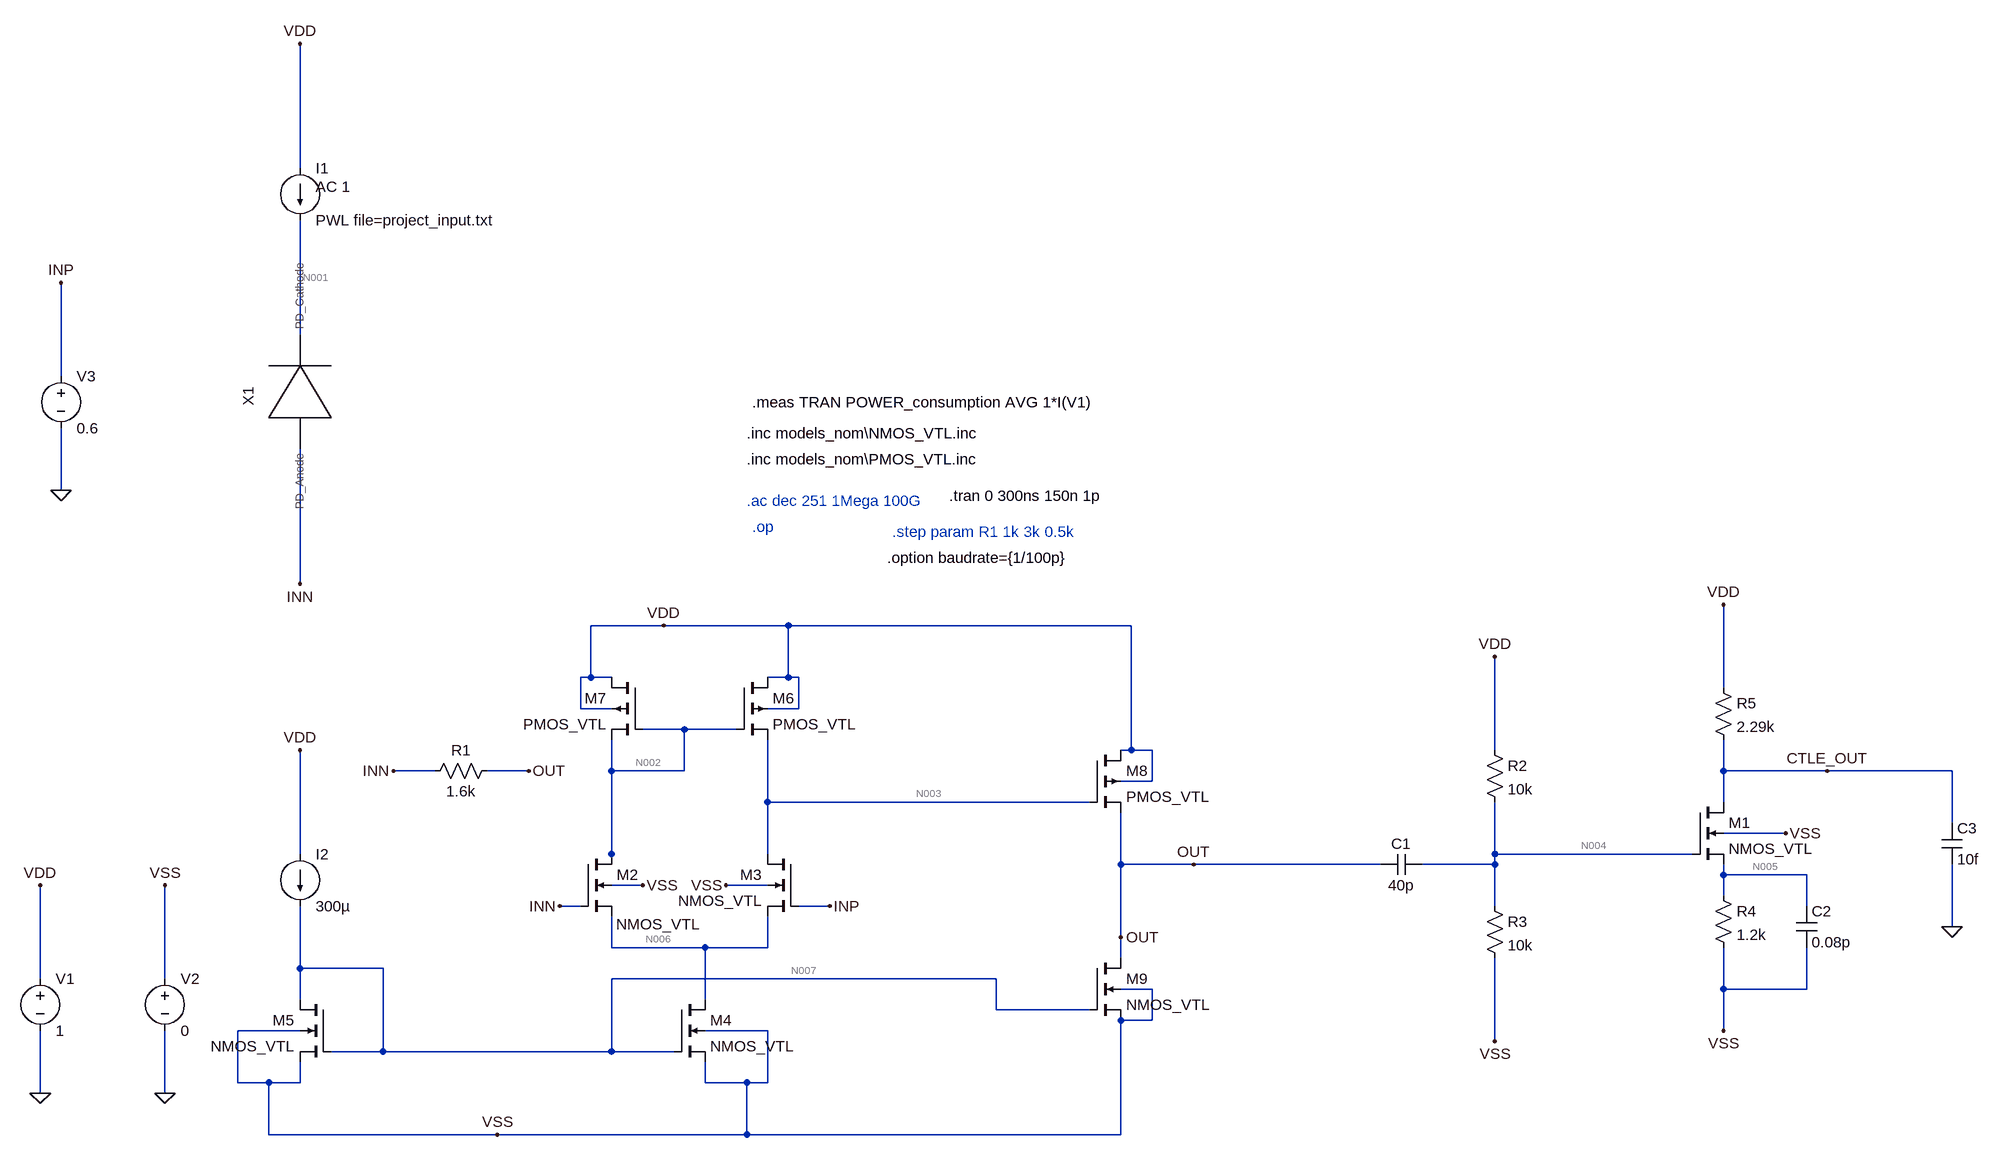
[diagram p0: schematic Project_2.asc]
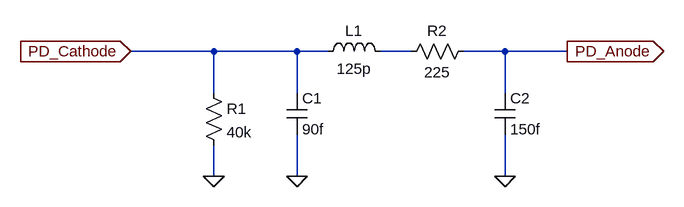
[diagram p1: sub-circuit photodiode.asc]
Project_2.asc, the LTspice schematic file:
Version 4
SHEET 1 1856 1004
WIRE -736 -528 -736 -720
WIRE -736 -272 -736 -448
WIRE -1104 -208 -1104 -352
WIRE -1104 -32 -1104 -128
WIRE -736 112 -736 -96
WIRE -176 176 -288 176
WIRE 16 176 -176 176
WIRE 544 176 16 176
WIRE -288 256 -288 176
WIRE -288 256 -304 256
WIRE -256 256 -288 256
WIRE 16 256 16 176
WIRE 16 256 -16 256
WIRE 32 256 16 256
WIRE 1456 272 1456 144
WIRE -304 304 -304 256
WIRE -256 304 -304 304
WIRE 32 304 32 256
WIRE 32 304 -16 304
WIRE -144 336 -208 336
WIRE -64 336 -144 336
WIRE 544 368 544 176
WIRE 544 368 528 368
WIRE 576 368 544 368
WIRE 1104 368 1104 224
WIRE -528 400 -592 400
WIRE -384 400 -448 400
WIRE -256 400 -256 352
WIRE -144 400 -144 336
WIRE -144 400 -256 400
WIRE 1456 400 1456 352
WIRE 1616 400 1456 400
WIRE 1808 400 1616 400
WIRE 576 416 576 368
WIRE 576 416 528 416
WIRE -16 448 -16 352
WIRE 480 448 -16 448
WIRE 1456 448 1456 400
WIRE 1808 480 1808 400
WIRE 1552 496 1456 496
WIRE -736 528 -736 368
WIRE -256 528 -256 400
WIRE -16 528 -16 448
WIRE 1104 528 1104 448
WIRE 1408 528 1104 528
WIRE -256 544 -256 528
WIRE 528 544 528 464
WIRE 640 544 528 544
WIRE 928 544 640 544
WIRE 1104 544 1104 528
WIRE 1104 544 992 544
WIRE 1456 560 1456 544
WIRE 1584 560 1456 560
WIRE -208 576 -256 576
WIRE -16 576 -80 576
WIRE 1456 592 1456 560
WIRE -304 608 -336 608
WIRE 80 608 32 608
WIRE 1104 608 1104 544
WIRE 1584 608 1584 560
WIRE 1808 640 1808 544
WIRE 528 656 528 544
WIRE -256 672 -256 624
WIRE -112 672 -256 672
WIRE -16 672 -16 624
WIRE -16 672 -112 672
WIRE 528 688 528 656
WIRE -736 704 -736 608
WIRE -608 704 -736 704
WIRE -1136 720 -1136 576
WIRE -944 720 -944 576
WIRE 336 720 -256 720
WIRE 576 736 528 736
WIRE 1456 736 1456 672
WIRE 1584 736 1584 672
WIRE 1584 736 1456 736
WIRE -736 752 -736 704
WIRE -112 752 -112 672
WIRE 336 768 336 720
WIRE 480 768 336 768
WIRE 576 784 576 736
WIRE 576 784 528 784
WIRE -736 800 -832 800
WIRE -16 800 -112 800
WIRE 1456 800 1456 736
WIRE 1104 816 1104 688
WIRE -608 832 -608 704
WIRE -608 832 -688 832
WIRE -256 832 -256 720
WIRE -256 832 -608 832
WIRE -160 832 -256 832
WIRE -832 880 -832 800
WIRE -784 880 -832 880
WIRE -736 880 -736 848
WIRE -736 880 -784 880
WIRE -112 880 -112 848
WIRE -48 880 -112 880
WIRE -16 880 -16 800
WIRE -16 880 -48 880
WIRE -1136 896 -1136 800
WIRE -944 896 -944 800
WIRE -784 960 -784 880
WIRE -432 960 -784 960
WIRE -48 960 -48 880
WIRE -48 960 -432 960
WIRE 528 960 528 784
WIRE 528 960 -48 960
FLAG -1136 896 0
FLAG -944 896 0
FLAG -944 576 VSS
FLAG -1136 576 VDD
FLAG -1104 -32 0
FLAG -1104 -352 INP
FLAG -736 -720 VDD
FLAG -736 112 INN
FLAG -592 400 INN
FLAG -384 400 OUT
FLAG 640 544 OUT
FLAG 1104 224 VDD
FLAG 1104 816 VSS
FLAG 1456 800 VSS
FLAG 1808 640 0
FLAG 1456 144 VDD
FLAG 1552 496 VSS
FLAG 1616 400 CTLE_OUT
FLAG -736 368 VDD
FLAG -336 608 INN
FLAG 80 608 INP
FLAG -208 576 VSS
FLAG -80 576 VSS
FLAG -432 960 VSS
FLAG -176 176 VDD
FLAG 528 656 OUT
DATAFLAG -736 80 ""
DATAFLAG -736 -352 ""
DATAFLAG -736 -640 ""
DATAFLAG 1744 400 ""
DATAFLAG 1280 528 ""
DATAFLAG 1488 560 ""
DATAFLAG -144 336 ""
DATAFLAG -736 384 ""
DATAFLAG -736 656 ""
DATAFLAG 224 448 ""
DATAFLAG 272 720 ""
DATAFLAG -480 832 ""
DATAFLAG 528 544 ""
DATAFLAG 64 176 ""
DATAFLAG -112 704 ""
DATAFLAG 64 608 ""
DATAFLAG -336 608 ""
SYMBOL voltage -1136 704 R0
WINDOW 123 0 0 Left 0
WINDOW 39 0 0 Left 0
SYMATTR InstName V1
SYMATTR Value 1
SYMBOL voltage -944 704 R0
WINDOW 123 0 0 Left 0
WINDOW 39 0 0 Left 0
SYMATTR InstName V2
SYMATTR Value 0
SYMBOL photodiode -736 -176 R270
SYMATTR InstName X1
SYMBOL current -736 -528 R0
WINDOW 123 24 28 Left 2
WINDOW 39 0 0 Left 0
SYMATTR Value2 AC 1
SYMATTR InstName I1
SYMATTR Value PWL file=project_input.txt
SYMBOL voltage -1104 -224 R0
WINDOW 123 0 0 Left 0
WINDOW 39 0 0 Left 0
SYMATTR InstName V3
SYMATTR Value 0.6
SYMBOL res -432 384 R90
WINDOW 0 0 56 VBottom 2
WINDOW 3 32 56 VTop 2
SYMATTR InstName R1
SYMATTR Value 1.6k
SYMBOL nmos4 1408 448 R0
SYMATTR InstName M1
SYMATTR Value NMOS_VTL
SYMATTR Value2 l=45n w=2.5u
SYMBOL cap 992 528 R90
WINDOW 0 0 32 VBottom 2
WINDOW 3 32 32 VTop 2
SYMATTR InstName C1
SYMATTR Value 40p
SYMBOL res 1088 352 R0
SYMATTR InstName R2
SYMATTR Value 10k
SYMBOL res 1088 592 R0
SYMATTR InstName R3
SYMATTR Value 10k
SYMBOL res 1440 576 R0
SYMATTR InstName R4
SYMATTR Value 1.2k
SYMBOL cap 1568 608 R0
SYMATTR InstName C2
SYMATTR Value 0.08p
SYMBOL res 1440 256 R0
SYMATTR InstName R5
SYMATTR Value 2.29k
SYMBOL cap 1792 480 R0
SYMATTR InstName C3
SYMATTR Value 10f
SYMBOL nmos4 -304 528 R0
WINDOW 3 55 108 Left 2
SYMATTR Value NMOS_VTL
SYMATTR InstName M2
SYMATTR Value2 l=45n w=4.5u
SYMBOL nmos4 32 528 M0
SYMATTR InstName M3
SYMATTR Value NMOS_VTL
SYMATTR Value2 l=45n w=4.5u
SYMBOL nmos4 -160 752 R0
SYMATTR InstName M4
SYMATTR Value NMOS_VTL
SYMATTR Value2 l=180n w=7u
SYMBOL nmos4 -688 752 M0
SYMATTR InstName M5
SYMATTR Value NMOS_VTL
SYMATTR Value2 l=180n w=4.5u
SYMBOL pmos4 -64 256 R0
SYMATTR InstName M6
SYMATTR Value PMOS_VTL
SYMATTR Value2 l=45n w=3u
SYMBOL pmos4 -208 256 M0
SYMATTR InstName M7
SYMATTR Value PMOS_VTL
SYMATTR Value2 l=45n w=3u
SYMBOL pmos4 480 368 R0
SYMATTR InstName M8
SYMATTR Value PMOS_VTL
SYMATTR Value2 l=45n w=2u
SYMBOL nmos4 480 688 R0
SYMATTR InstName M9
SYMATTR Value NMOS_VTL
SYMATTR Value2 l=180n w=4.5u
SYMBOL current -736 528 R0
WINDOW 123 0 0 Left 0
WINDOW 39 0 0 Left 0
SYMATTR InstName I2
SYMATTR Value 300µ
TEXT -48 -120 Left 2 !.inc models_nom\\NMOS_VTL.inc
TEXT -48 -80 Left 2 !.inc models_nom\\PMOS_VTL.inc
TEXT -48 -16 Left 2 ;.ac dec 251 1Mega 100G
TEXT -40 24 Left 2 ;.op
TEXT 264 -24 Left 2 !.tran 0 300ns 150n 1p
TEXT 176 32 Left 2 ;.step param R1 1k 3k 0.5k
TEXT 168 72 Left 2 !.option baudrate={1/100p}
TEXT -40 -168 Left 2 !.meas TRAN POWER_consumption AVG 1*I(V1)

photodiode.asc, the sub-circuit schematic file:
Version 4
SHEET 1 1476 712
WIRE 16 -32 -112 -32
WIRE 144 -32 16 -32
WIRE 192 -32 144 -32
WIRE 320 -32 272 -32
WIRE 464 -32 400 -32
WIRE 560 -32 464 -32
WIRE 16 32 16 -32
WIRE 144 32 144 -32
WIRE 464 32 464 -32
WIRE 16 160 16 112
WIRE 144 160 144 96
WIRE 464 160 464 96
FLAG 16 160 0
FLAG 144 160 0
FLAG 464 160 0
FLAG -112 -32 PD_Cathode
IOPIN -112 -32 In
FLAG 560 -32 PD_Anode
IOPIN 560 -32 Out
SYMBOL res 0 16 R0
SYMATTR InstName R1
SYMATTR Value 40k
SYMBOL cap 128 32 R0
SYMATTR InstName C1
SYMATTR Value 90f
SYMBOL cap 448 32 R0
SYMATTR InstName C2
SYMATTR Value 150f
SYMBOL ind 176 -16 R270
WINDOW 0 32 56 VTop 2
WINDOW 3 5 56 VBottom 2
SYMATTR InstName L1
SYMATTR Value 125p
SYMBOL res 416 -48 R90
WINDOW 0 0 56 VBottom 2
WINDOW 3 32 56 VTop 2
SYMATTR InstName R2
SYMATTR Value 225

The netlist it stands for:
* Project_2.asc
V1 VDD 0 1
V2 VSS 0 0
XX1 INN N001 photodiode
I1 VDD N001 PWL file=project_input.txt AC 1
V3 INP 0 0.6
R1 OUT INN 1.6k
M1 CTLE_OUT N004 N005 VSS NMOS_VTL l=45n w=2.5u
C1 N004 OUT 40p
R2 VDD N004 10k
R3 N004 VSS 10k
R4 N005 VSS 1.2k
C2 N005 VSS 0.08p
R5 VDD CTLE_OUT 2.29k
C3 CTLE_OUT 0 10f
M2 N002 INN N006 VSS NMOS_VTL l=45n w=4.5u
M3 N003 INP N006 VSS NMOS_VTL l=45n w=4.5u
M4 N006 N007 VSS VSS NMOS_VTL l=180n w=7u
M5 N007 N007 VSS VSS NMOS_VTL l=180n w=4.5u
M6 VDD N002 N003 VDD PMOS_VTL l=45n w=3u
M7 VDD N002 N002 VDD PMOS_VTL l=45n w=3u
M8 VDD N003 OUT VDD PMOS_VTL l=45n w=2u
M9 OUT N007 VSS VSS NMOS_VTL l=180n w=4.5u
I2 VDD N007 300µ

* block symbol definitions
.subckt photodiode PD_Anode PD_Cathode
R1 PD_Cathode 0 40k
C1 PD_Cathode 0 90f
C2 PD_Anode 0 150f
L1 PD_Cathode N001 125p
R2 PD_Anode N001 225
.ends photodiode

.model NMOS NMOS
.model PMOS PMOS
.lib standard.mos
.inc models_nom\NMOS_VTL.inc
.inc models_nom\PMOS_VTL.inc
* .ac dec 251 1Mega 100G
* .op
.tran 0 300ns 150n 1p
* .step param R1 1k 3k 0.5k
.option baudrate={1/100p}
.meas TRAN POWER_consumption AVG 1*I(V1)
.backanno
.end

* Results of the author's LTspice run, read from the files saved beside the schematic
* Operating Point, zero values left out:
*   V(vdd) = 1 V
*   V(n001) = 664.5 mV
*   V(inn) = 623.2 mV
*   V(inp) = 600 mV
*   V(out) = 329.8 mV
*   V(ctle_out) = 666.3 mV
*   V(n004) = 500 mV
*   V(n005) = 174.9 mV
*   V(n002) = 637.3 mV
*   V(n006) = 267.1 mV
*   V(n003) = 725.1 mV
*   V(n007) = 521 mV
*   Id(M1) = 145.7 µA
*   Ig(M1) = 36.35 pA
*   Ib(M1) = -1.436 pA
*   Is(M1) = -145.7 µA
*   Id(M2) = 246.2 µA
*   Ig(M2) = 122.6 pA
*   Ib(M2) = -1.893 pA
*   Is(M2) = -246.2 µA
*   Id(M3) = 207.3 µA
*   Ig(M3) = 81.07 pA
*   Ib(M3) = -1.95 pA
*   Is(M3) = -207.3 µA
*   Id(M4) = 453.5 µA
*   Ig(M4) = 6.245 nA
*   Ib(M4) = -29.58 pA
*   Is(M4) = -453.5 µA
*   Id(M5) = 300 µA
*   Ig(M5) = 3.961 nA
*   Ib(M5) = -19.5 pA
*   Is(M5) = -300 µA
*   Id(M9) = 295 µA
*   Ig(M9) = 3.985 nA
*   Ib(M9) = -19.2 pA
*   Is(M9) = -295 µA
*   Id(M6) = 207.3 µA
*   Ig(M6) = -192.6 pA
*   Is(M6) = -207.3 µA
*   Id(M7) = 246.2 µA
*   Ig(M7) = -190.5 pA
*   Is(M7) = -246.2 µA
*   Id(M8) = 111.6 µA
*   Ig(M8) = 44.3 pA
*   Ib(M8) = 1.154 pA
*   Is(M8) = -111.6 µA
*   I(I1) = 200 µA
*   I(I2) = 300 µA
*   I(R1) = -183.4 µA
*   I(R2) = 50 µA
*   I(R3) = 50 µA
*   I(R4) = 145.7 µA
*   I(R5) = 145.7 µA
*   I(V1) = -1.261 mA
*   I(V2) = 1.244 mA
*   I(V3) = -81.07 pA
*   Ix(x1:PD_ANODE) = -183.4 µA
*   Ix(x1:PD_CATHODE) = 200 µA
* From the log:
*   power_consumption: AVG(1*i(v1))=-0.00128531 FROM 0 TO 1.5e-07